# Altium schematic sheet 01-Revision_History_and_Contents.SchDoc: Revision History and Table of Contents
size A; Revision: A; SheetNumber: 1; SheetTotal: 4; ECE315_Project_Name: ECE453 F23 Base Project
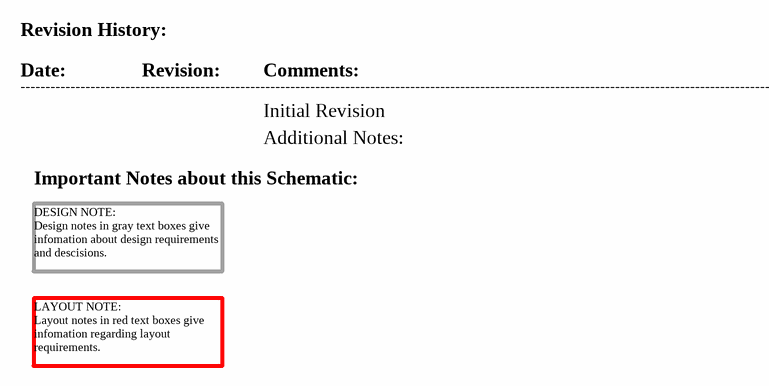
[diagram p0: 01-Revision_History_and_Contents.SchDoc]

## Notes on the sheet
- Revision History:
- Date:
- ----------------------------------------------------------------------------------------------------------------------------------------------------------------------
- Revision:
- Comments:
- Initial Revision
- Important Notes about this Schematic:
- Additional Notes:
- DESIGN NOTE:
  Design notes in gray text boxes give infomation about design requirements and descisions.
- LAYOUT NOTE:
  Layout notes in red text boxes give infomation regarding layout requirements.
- Title:
- Size:
- A
- Project
- Rev:
- Sheet:
- of
- College of Engineering
- 1415 Engineering Drive
- Madison, WI 53706